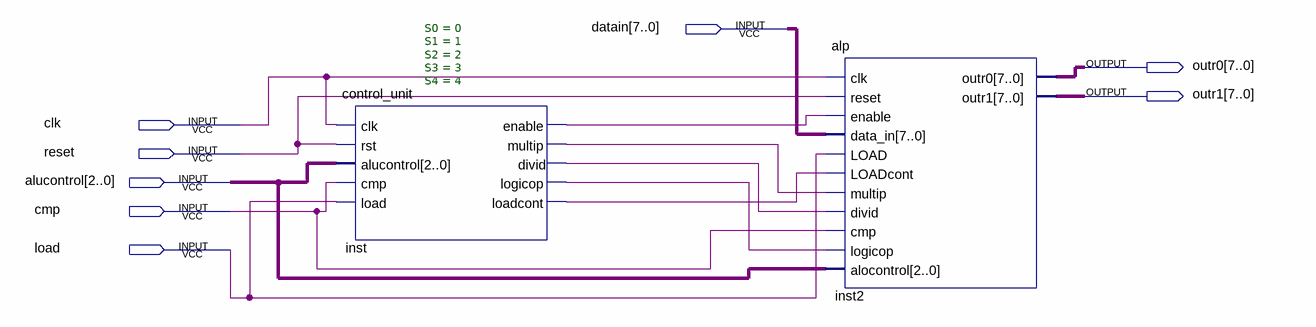
[diagram p0: schematic sheet]
// Quartus schematic overall.bdf as structural Verilog: 2 symbols, 8 pins
module overall (
  input  [7:0] datain,
  input  clk,
  input  reset,
  input  [2:0] alucontrol,
  input  cmp,
  input  load,
  output [7:0] outr0,
  output [7:0] outr1
);

  wire inst_divid, inst_enable, inst_loadcont, inst_logicop, inst_multip;

  control_unit #(.S0(0), .S1(1), .S2(2), .S3(3), .S4(4)) inst (
    .clk(clk), .rst(reset), .alucontrol(alucontrol), .cmp(cmp), .load(load), .enable(inst_enable),
    .multip(inst_multip), .divid(inst_divid), .logicop(inst_logicop), .loadcont(inst_loadcont));
  alp inst2 (
    .clk(clk), .reset(reset), .enable(inst_enable), .data_in(datain), .LOAD(load), .LOADcont(inst_loadcont),
    .multip(inst_multip), .divid(inst_divid), .cmp(cmp), .logicop(inst_logicop), .alocontrol(alucontrol),
    .outr0(outr0), .outr1(outr1));
endmodule
